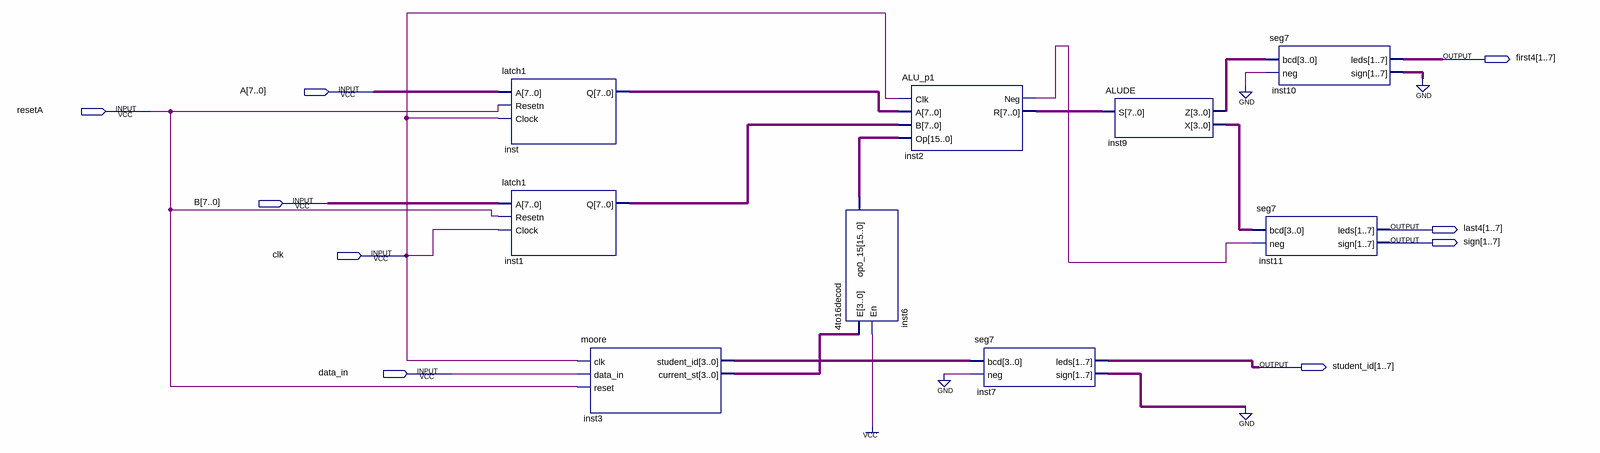
[diagram p0: schematic sheet]
// Quartus schematic alupart1.bdf as structural Verilog: 9 symbols, 9 pins
module alupart1 (
  input  [7:0] A,
  input  resetA,
  input  [7:0] B,
  input  clk,
  input  data_in,
  output [1:7] first4,
  output [1:7] last4,
  output [1:7] sign,
  output [1:7] student_id
);

  wire inst2_neg;
  wire [3:0] inst3_current_st, inst3_student_id, inst9_x, inst9_z;
  wire [6:0] inst7_sign, inst10_sign;
  wire [7:0] inst1_q, inst2_r, inst_q;
  wire [15:0] inst6_op0_15;

  latch1 inst (.A(A), .Resetn(resetA), .Clock(clk), .Q(inst_q));
  latch1 inst1 (.A(B), .Resetn(resetA), .Clock(clk), .Q(inst1_q));
  moore inst3 (
    .clk(clk), .data_in(data_in), .reset(resetA), .student_id(inst3_student_id), .current_st(inst3_current_st));
  \4to16decod  inst6 (.E(inst3_current_st), .En(1'b1), .op0_15(inst6_op0_15));
  ALU_p1 inst2 (.Clk(clk), .A(inst_q), .B(inst1_q), .Op(inst6_op0_15), .Neg(inst2_neg), .R(inst2_r));
  seg7 inst7 (.bcd(inst3_student_id), .neg(1'b0), .leds(student_id), .sign(inst7_sign));
  ALUDE inst9 (.S(inst2_r), .Z(inst9_z), .X(inst9_x));
  seg7 inst10 (.bcd(inst9_z), .neg(1'b0), .leds(first4), .sign(inst10_sign));
  seg7 inst11 (.bcd(inst9_x), .neg(inst2_neg), .leds(last4), .sign(sign));
  // also tied to GND on the sheet: {inst7_sign[0], inst7_sign[1], inst7_sign[2], inst7_sign[3], inst7_sign[4], inst7_sign[5], inst7_sign[6], inst10_sign[0], inst10_sign[1], inst10_sign[2], inst10_sign[3], inst10_sign[4], inst10_sign[5], inst10_sign[6]}
endmodule
